# EAGLE design Sensors (EAGLE 9.6.2)
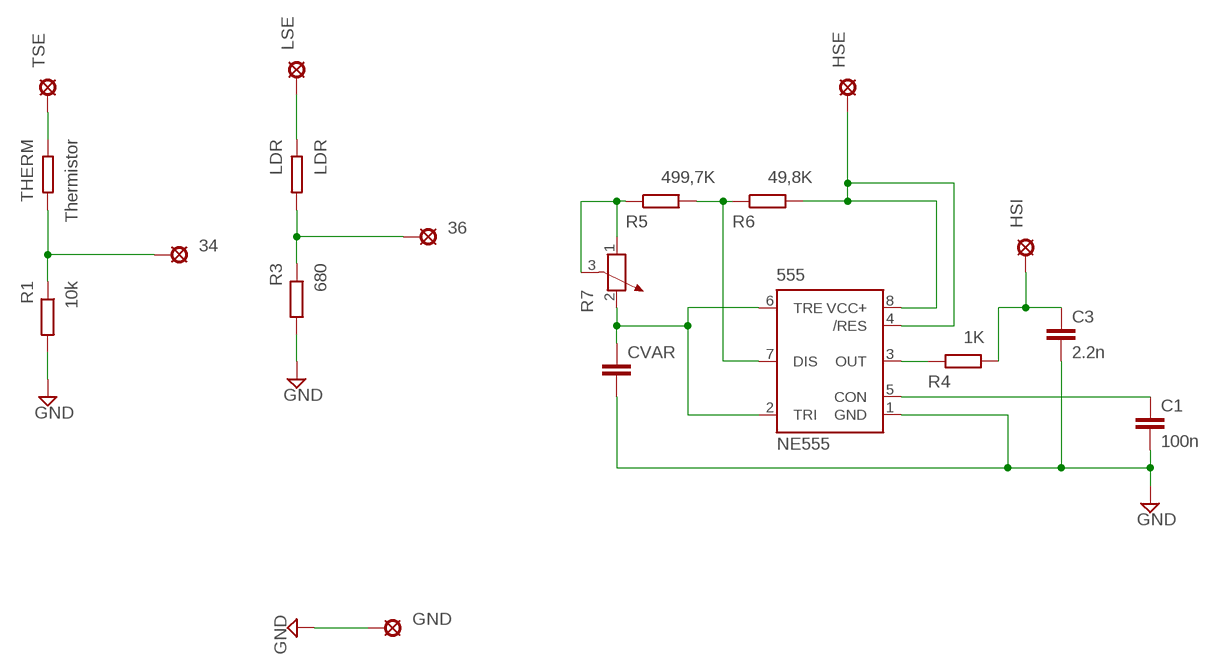
[diagram p0: schematic, sheet 1]

## Parts
34  SE13  [SE13]
36  36  SE13  [SE13]
555  NE555  [DIL-08]
C1  100n  C-EUC0805  [C0805]
C3  2.2n  C-EUC0805  [C0805]
CVAR  C-EU050-025X075  [C050-025X075]
GND  SE13  [SE13]
HSE  SE13  [SE13]
HSI  SE13  [SE13]
LDR  LDR  WEERSTAND  [WEERSTAND]
LSE  SE13  [SE13]
R1  10k  R-EU_R0805  [R0805]
R3  680  R-EU_R0805  [R0805]
R4  1K  R-EU_R0805  [R0805]
R5  499,7K  R-EU_R0805  [R0805]
R6  49,8K  R-EU_R0805  [R0805]
R7  POTENTIOMETER_PT-10  [PT-10]
THERM  Thermistor  WEERSTAND  [WEERSTAND]
TSE  SE13  [SE13]

## Nets
34: 34.MP R1.1 THERM.P$2
36: 36.MP LDR.P$2 R3.1
GND: 555.1(GND) C1.2 C3.2 CVAR.2 GND.MP R1.2 R3.2
N$1: THERM.P$1 TSE.MP
N$2: LDR.P$1 LSE.MP
N$3: 555.5(CON) C1.1
N$4: C3.1 HSI.MP R4.2
N$5: 555.3(OUT) R4.1
N$6: 555.4(/RES) 555.8(VCC+) HSE.MP R6.2
N$7: 555.2(TRI) 555.6(TRE) CVAR.1 R7.2
N$8: R5.1 R7.1 R7.3
N$10: 555.7(DIS) R5.2 R6.1

## Library data of the parts
34 36 GND HSE HSI LSE TSE = solpad:SE13: SOLDER PAD E1542, drill 1,3mm, distributor Buerklin, 07F815
555 = st-microelectronics:NE555: General purpose bipolar Timer; MF: Arrow Electronics; MPN: NE555N; OC_FARNELL: 1467742; OC_NEWARK: 89K1486
C1 C3 CVAR = rcl:C-EU: CAPACITOR, European symbol; SPICEPREFIX: C
LDR THERM = iee4:WEERSTAND
R1 R3-R6 = rcl:R-EU_: RESISTOR, European symbol; SPICEPREFIX: R
R7 = rcl:POTENTIOMETER_: Potentiometer; SPICEMODEL: POT; SPICEPREFIX: X

## Board
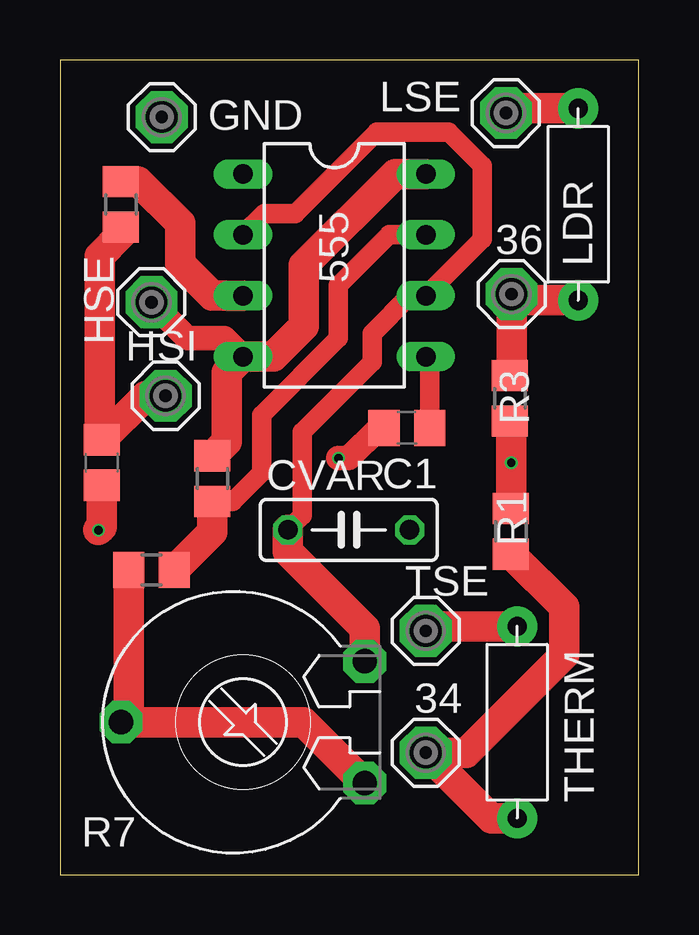
[diagram p1: board, top side]
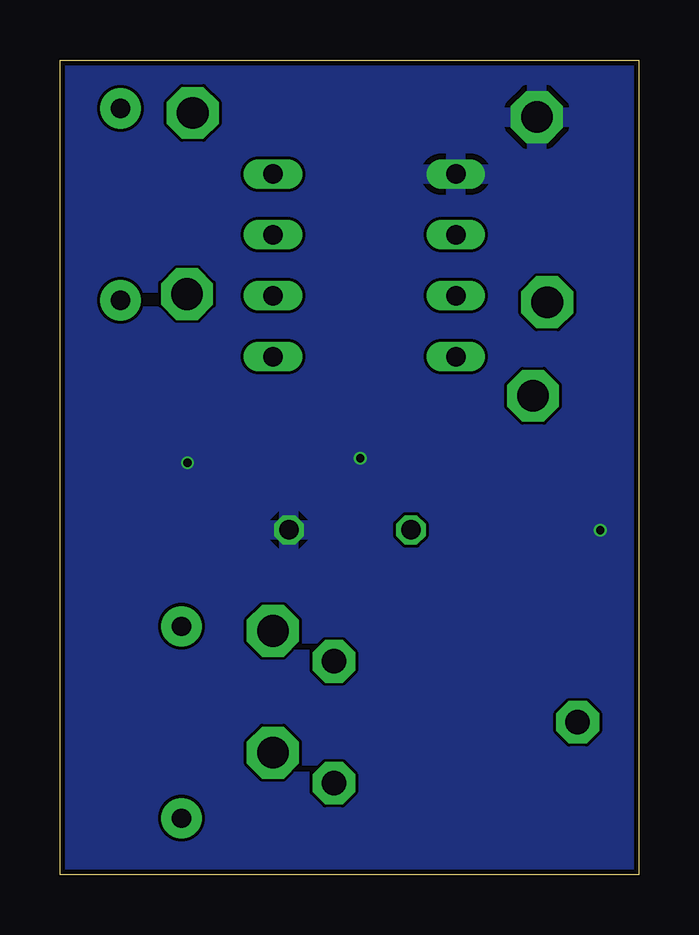
[diagram p2: board, bottom side, seen from below]

Size 24.11 x 33.96 mm. Coordinates in mm from the lower left corner, seen from the top.
Outline: 0,0 24.11,0 24.11,33.96 0,33.96 0,0
Copper layers (1*16): Top 0.035559375mm / dielectric 1.6mm / Bottom 0.035559375mm
Design rules "jlcpcb2layer": minimum track width 5mil, minimum drill 12mil, track to track 5mil, track to pad 5mil, pad to pad 5mil, via to via 5mil, smd to smd 5mil, copper to edge 8mil, drill to drill 6mil, minimum pad ring 5mil, minimum via ring 3mil, stop-mask expansion 2.5mil, vias tented up to drill 0mil, thermal gap 10mil

### Footprints (pad centres in the part's own frame; a part is rotated, then mirrored left to right if it is on the bottom)
SE13 = drill 1.321 pad 2.159 octagon: MP 0,0
DIL-08 = drill 0.813 long: 1 -3.81,-3.81; 2 -1.27,-3.81; 3 1.27,-3.81; 4 3.81,-3.81; 5 3.81,3.81; 6 1.27,3.81; 7 -1.27,3.81; 8 -3.81,3.81
C0805 = smd 1.3 x 1.5: 1 -0.95,0; 2 0.95,0
C050-025X075 = drill 0.813 octagon: 1 -2.54,0; 2 2.54,0
WEERSTAND = drill 0.8 pad 1.676: P$1 -4,0; P$2 4,0
R0805 = smd 1.3 x 1.5: 1 -0.95,0; 2 0.95,0
PT-10 = drill 1.016 pad 1.778 octagon: 1 -2.54,-5.08; 2 2.54,-5.08; 3 0,5.08

### Placement (x,y rotation side)
34  15.24,5.08 0 top
36  18.82,24.2 0 top
555  11.43,25.4 270 top
C1  14.45,18.62 180 top
C3  1.74,17.18 270 top
CVAR  12.03,14.37 0 top
GND  4.24,31.58 0 top
HSE  3.81,23.86 0 top
HSI  4.4,19.96 0 top
LDR  21.59,27.94 270 top
LSE  18.58,31.75 0 top
R1  18.79,14.31 90 top
R3  18.74,19.85 270 top
R4  2.54,27.94 270 top
R5  3.81,12.7 0 top
R6  6.35,16.51 90 top
R7  7.62,6.35 90 top
THERM  19.05,6.35 270 top
TSE  15.24,10.16 0 top

### Tracks (layer width: path | path; a pad name or v marks a point on that pad's centre or on a via)
34
  Top 1.27: THERM.P$2 17.97,2.35 34.MP 16.92,5.08 21,9.16 21,11.15 R1.1
36
  Top 1.27: LDR.P$2 19.07,23.94 36.MP 18.82,20.88 R3.1
GND  (via drill 0.35)
  Top 1.016: C1.2 13.3,18.62 12.04,17.36 v11.6,17.36
  Top 1.27: C3.2 1.74,14.5 v1.6,14.36 | 18.79,18.85 R3.2 18.8,18.84 v18.8,17.16 R1.2
  pour Bottom: 0,33.96 24.2,33.96 24.2,0.16 0,0.16
N$1
  Top 1.27: TSE.MP 15.43,10.35 THERM.P$1
N$2
  Top 1.27: LSE.MP 18.77,31.94 LDR.P$1
N$3
  Top 0.813: 555.5 15.4,21.43 C1.1
N$4
  Top 1.27: R4.2 2.54,26.67 1.65,25.78 1.65,18.22 C3.1 3.57,19.96 HSI.MP
N$5
  Top 1.27: 555.3 6.35,24.13 5,25.48 5,27.16 3.27,28.89 R4.1
N$6
  Top 1.016: HSE.MP 5.31,22.36 6.85,22.36 555.4
  Top 1.27: 555.8 13.97,29.21 10.16,25.4 10.16,22.86 8.89,21.59 555.4 6.95,20.92 6.95,18.06 R6.2
N$7
  Top 0.813: 555.2 8.51,27.56 9.8,27.56 13.2,30.96 16.2,30.96 17.6,29.56 17.6,26.49 555.6 14.57,24.13 13,22.56 13,21.36 10.09,18.45 10.09,14.97 CVAR.1
  Top 1.27: R7.2 12.7,10.26 9.49,13.47 CVAR.1
N$8
  Top 1.27: R5.1 2.86,6.67 R7.3 10.16,6.35 R7.1
N$10
  Top 0.813: R6.1 7.2,15.56 8.4,16.76 8.4,19.16 11.6,22.36 11.6,24.56 13.71,26.67 555.7
  Top 1.27: R5.2 6.35,14.29 R6.1